# Altium schematic sheet Battery_Management.SchDoc: Battery Management
size A3; SheetNumber: 4; SheetTotal: 6
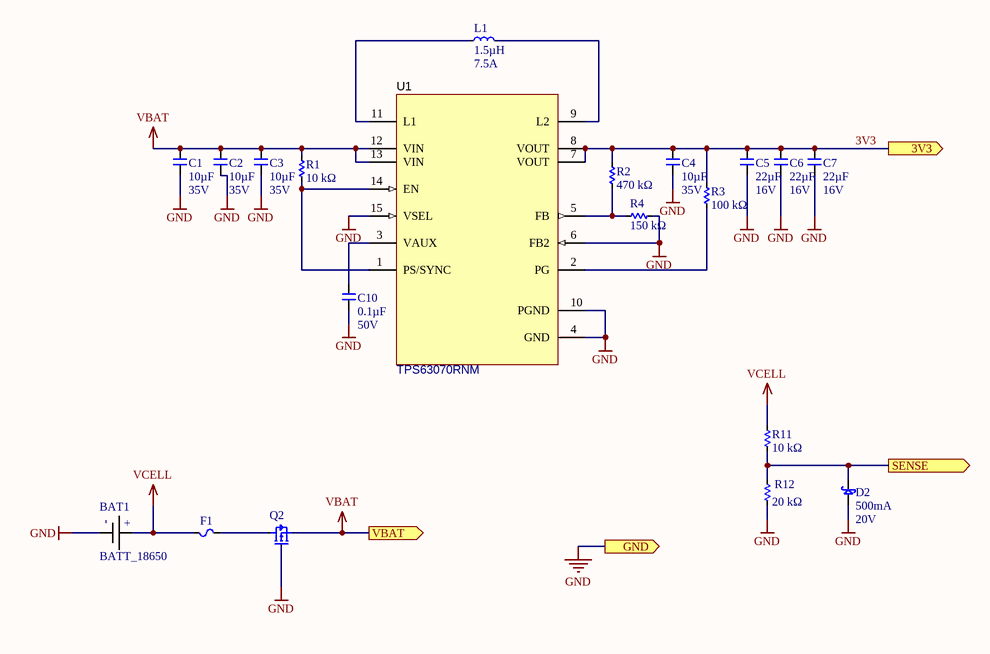
[diagram p0: Battery_Management.SchDoc]

## Parts
BAT1  BATT_18650  [BATT_18650_KEYSTONE_1042_VIAS]
C1  Capacitance (shorthand): 10µF  Rated Voltage: 35V  [C0603]  (hidden comment: 490-13248-1-ND)
C2  Capacitance (shorthand): 10µF  Rated Voltage: 35V  [C0603]  (hidden comment: 490-13248-1-ND)
C3  Capacitance (shorthand): 10µF  Rated Voltage: 35V  [C0603]  (hidden comment: 490-13248-1-ND)
C4  Capacitance (shorthand): 10µF  Rated Voltage: 35V  [C0603]  (hidden comment: 490-13248-1-ND)
C5  Capacitance (shorthand): 22µF  Rated Voltage: 16V  [C0603]  (hidden comment: 1276-7076-1-ND)
C6  Capacitance (shorthand): 22µF  Rated Voltage: 16V  [C0603]  (hidden comment: 1276-7076-1-ND)
C7  Capacitance (shorthand): 22µF  Rated Voltage: 16V  [C0603]  (hidden comment: 1276-7076-1-ND)
C10  Capacitance (shorthand): 0.1µF  Rated Voltage: 50V  [C0603]  (hidden comment: 490-1519-1-ND)
D2  Current - Average Rectified (Io): 500mA  Voltage - DC Reverse (Vr) (Max): 20V  [SOD123]  (hidden comment: Symbol)
F1  Symbol  [R1206]  (value not drawn)
L1  Inductance: 1.5µH  Current Rating: 7.5A  [SMD5230]  (hidden comment: Symbol)
Q2  PFET_SI7615ADN-T1  [POWERPAK_1212-8_SINGLE]  (value not drawn)
R1  Resistance: 10 kΩ  [R0603]  (hidden comment: 311-10.0KHRCT-ND)
R2  Resistance: 470 kΩ  [R0603]  (hidden comment: 311-470KHRCT-ND)
R3  Resistance: 100 kΩ  [R0603]  (hidden comment: 311-100KHRCT-ND)
R4  Resistance: 150 kΩ  [R0603]  (hidden comment: 311-150KHRCT-ND)
R11  Resistance: 10 kΩ  [R0603]  (hidden comment: 311-10.0KHRCT-ND)
R12  Resistance: 20 kΩ  [R0603]  (hidden comment: 311-20.0KHRCT-ND)
U1  TPS63070RNM  [TPS63070]

## Ports
3V3 (out), GND (out), SENSE (out), VBAT (out)

## Nets
GND: BAT1.CELL- C1.2 C2.2 C3.2 C4.2 C5.2 C6.2 C7.2 C10.2 D2.1 Q2.4 R4.2 R12.1 U1.4(GND) U1.6(FB2) U1.10(PGND) U1.15(VSEL) ; port GND
VBAT: C1.1 C2.1 C3.1 Q2.1 R1.2 U1.12(VIN) U1.13(VIN) ; port VBAT
VCELL: BAT1.CELL+ F1.1 R11.2
3V3: C4.1 C5.1 C6.1 C7.1 R2.2 R3.2 U1.7(VOUT) U1.8(VOUT) ; port 3V3
SENSE: D2.2 R11.1 R12.2 ; port SENSE
NetC10_1: C10.1 U1.3(VAUX)
NetF1_2: F1.2 Q2.5
NetL1_1: L1.1 U1.11(L1)
NetL1_2: L1.2 U1.9(L2)
NetR1_1: R1.1 U1.1(PS/SYNC) U1.14(EN)
NetR2_1: R2.1 R4.1 U1.5(FB)
NetR3_1: R3.1 U1.2(PG)

## Notes on the sheet
- Title
- Size:
- Date:
- A3
- Number:
- Time:
- Revision:
- Sheet
- of
- File:
- (in symbol CMP-030-0003-3) +

## Library data of the parts
BAT1 = CMP-030-0003-3: Dual Lithium Ion Cell Holder; Manufacturer: Keystone Electronics; Manufacturer Part Number: 1048P; Battery Type, Function: Cylindrical, Holder; Style: Holder (Open); Battery Cell Size: 18650; Number of Cells: 2; Body Material: Nylon; RoHS: RoHS Compliant; Battery Series: -; Mounting Type: PCB, Surface Mount; Termination Style: SMD (SMT) Tab; Height Above Board: 0.585" (14.86mm); Operating Temperature: -50°C ~ 145°C; ComponentLink1URL: http://www.keyelco.com/product-pdf.cfm?p=13959; ComponentLink1Description: http://www.keyelco.com/product-pdf.cfm?p=13959; Stock 1: 6575; Pricing 1: 1=2.76000, 10=2.32100, 50=2.03840, 250=1.76540, 1000=1.63000, 2500=1.40140, 5000=1.27400 (USD); Mount: Surface Mount; Case/Package: SMD/SMT; Material: Nylon; Contact Plating: Tin; Contact Material: Bronze; Min Operating Temperature: -50°C; Max Operating Temperature: 145°C; Package Quantity: 1; Packaging: Tray; Termination: SMD/SMT; Lead Free: Lead Free; ComponentLink2URL: https://datasheet.ciiva.com/4/1042-4715.pdf?src-supplier=Digi-Key; ComponentLink2Description: https://datasheet.ciiva.com/4/1042-4715.pdf?src-supplier=Digi-Key; ComponentLink3URL: https://datasheet.ciiva.com/3353/key1042-rev-eng-tds-3353207.pdf?src-supplier=Distrelec; ComponentLink3Description: https://datasheet.ciiva.com/3353/key1042-rev-eng-tds-3353207.pdf?src-supplier=Distrelec; Design Item ID: BATT_18650; Source: connector.SchLib
C1-C4 = CMP-119-0071-1: CAP CER 10UF 35V X5R 0603 20%; Manufacturer: Murata Electronics North America; Capacitance - pF (Machine readable): #NAME?; Dielectric: X5R
C5-C7 = CMP-119-0072-1: CAP CER 22UF 16V X5R 0603 20%; Manufacturer: Samsung Electro-Mechanics; Capacitance - pF (Machine readable): #NAME?; Dielectric: X5R
C10 = CMP-119-0065-1: CAP CER 0603 0.1µF X7R 50V 10%; Manufacturer: Murata Electronics North America; Capacitance - pF (Machine readable): #NAME?; Dielectric: X7R
D2 = CMP-033-0037-1: DIODE SCHOTTKY 0.5A 20V SOD-123; Manufacturer: Fairchild Semiconductor; Manufacturer Part Number: MBR0520L; Speed: Fast Recovery =< 500ns, > 200mA (Io); Current - Reverse Leakage @ Vr: 250µA @ 20V; Voltage - Forward (Vf) (Max) @ If: 385mV @ 500mA; RoHS: RoHS Compliant; Stock 1: 217232; Pricing 1: 1=0.63, 10=0.43, 100=0.2024, 250=0.1442, 500=0.11006, 750=0.08603, 1000=0.0759 (USD); Diode Type: Schottky; Reverse Recovery Time (trr): -; Capacitance @ Vr, F: -; Mounting Type: Surface Mount; Package / Case: SOD-123; Supplier Device Package: SOD-123; Packaging: Cut Tape (CT); ComponentLink1URL: http://www.fairchildsemi.com/ds/MB/MBR0520L.pdf; ComponentLink1Description: Datasheet; Design Item ID: SCHOTTKY_MBR0520L; Source: diode.SchLib
F1 = CMP-035-0003-1: Design Item ID: __template_fuse; Source: fuse.SchLib
L1 = CMP-052-0036-1: INDUCTOR POWER 1.5UH 7.5A SMD; Manufacturer: Vishay Dale; Manufacturer Part Number: IHLP2020CZER1R5M11; Current - Saturation: 7A; Tolerance: ±20%; Shielding: Shielded; DC Resistance (DCR): 18.5 mOhm Max; Frequency - Test: 100kHz; RoHS: RoHS Compliant; Stock 1: 17936; Pricing 1: 1=2.29, 10=1.86, 100=1.55, 500=1.24, 1000=1.116 (USD); Material - Core: -; Q @ Freq: -; Frequency - Self Resonant: -; Operating Temperature: -55°C ~ 125°C; Package / Case: Non Standard; Size / Dimension: 0.216" L x 0.204" W x 0.118" H (5.49mm x 5.18mm x 3.00mm); Mounting Type: Surface Mount; Packaging: Cut Tape (CT); ComponentLink1URL: http://www.vishay.com/docs/34260/lp20cz11.pdf; ComponentLink1Description: Datasheet; Design Item ID: IND_IHLP2020CZER1R5M11; Source: inductor.SchLib
Q2 = CMP-078-0043-2: MOSFET P-CH 20V 35A PPK; Manufacturer Part Number: SI7615ADN-T1-GE3; Manufacturer: Vishay Siliconix; Power - Max: 52W; FET Feature: Standard; FET Type: MOSFET P-Channel, Metal Oxide; Rds On (Max) @ Id, Vgs: 4.4 mOhm @ 20A, 10V; Input Capacitance (Ciss) @ Vds: 5590pF @ 10V; Current - Continuous Drain (Id) @ 25°C: 35A (Tc); Vgs(th) (Max) @ Id: 1.5V @ 250µA; Gate Charge (Qg) @ Vgs: 183nC @ 10V; Source: transistor_fet.SchLib; Supplier Device Package: PowerPAK® 1212-8; Drain to Source Voltage (Vdss): 20V; Design Item ID: PFET_SI7615ADN-T1; Stock 1: 98451; Operating Temperature: -55°C ~ 150°C (TJ); RoHS: RoHS Compliant; Pricing 1: 1=0.73, 10=0.646, 25=0.6068, 100=0.4951, 250=0.45988, 500=0.3914, 1000=0.31312 (USD); Mounting Type: Surface Mount; Packaging: Cut Tape (CT); ComponentLink1URL: http://www.vishay.com/docs/62667/si7615adn.pdf; Package / Case: PowerPAK® 1212-8; ComponentLink1Description: http://www.vishay.com/docs/62667/si7615adn.pdf; Part Status: Active
R1 R11 = CMP-126-0273-1: RES SMD 10K OHM 1% 1/10W 0603; Manufacturer Part Number: RC0603FR-0710KL; Manufacturer: Yageo; Resistance (Sortable): 10000; Power (Watts): 0.1W, 1/10W; Temperature Coefficient: ±100ppm/°C; Datasheets: http://www.yageo.com/documents/recent/PYu-RC_Group_51_RoHS_L_9.pdf; Image: //media.digikey.com/Renders/Yageo%20Renders/0603-(1608-Metric).jpg; Tolerance: ±1%; Operating Temperature: -55°C ~ 155°C
R2 = CMP-126-0450-1: RES SMD 470K OHM 1% 1/10W 0603; Manufacturer Part Number: RC0603FR-07470KL; Manufacturer: Yageo; Power (Watts): 0.1W, 1/10W; Resistance (Sortable): 470000; Temperature Coefficient: ±100ppm/°C; Tolerance: ±1%; Datasheets: http://www.yageo.com/documents/recent/PYu-RC_Group_51_RoHS_L_9.pdf; Image: //media.digikey.com/Renders/Yageo%20Renders/0603-(1608-Metric).jpg; Operating Temperature: -55°C ~ 155°C
R3 = CMP-126-0382-1: RES SMD 100K OHM 1% 1/10W 0603; Manufacturer Part Number: RC0603FR-07100KL; Manufacturer: Yageo; Power (Watts): 0.1W, 1/10W; Resistance (Sortable): 100000; Temperature Coefficient: ±100ppm/°C; Tolerance: ±1%; Datasheets: http://www.yageo.com/documents/recent/PYu-RC_Group_51_RoHS_L_9.pdf; Image: //media.digikey.com/Renders/Yageo%20Renders/0603-(1608-Metric).jpg; Operating Temperature: -55°C ~ 155°C
R4 = CMP-126-0400-1: RES SMD 150K OHM 1% 1/10W 0603; Manufacturer Part Number: RC0603FR-07150KL; Manufacturer: Yageo; Power (Watts): 0.1W, 1/10W; Resistance (Sortable): 150000; Temperature Coefficient: ±100ppm/°C; Tolerance: ±1%; Datasheets: http://www.yageo.com/documents/recent/PYu-RC_Group_51_RoHS_L_9.pdf; Image: //media.digikey.com/Renders/Yageo%20Renders/0603-(1608-Metric).jpg; Operating Temperature: -55°C ~ 155°C
R12 = CMP-126-0304-1: RES SMD 20K OHM 1% 1/10W 0603; Manufacturer Part Number: RC0603FR-0720KL; Manufacturer: Yageo; Resistance (Sortable): 20000; Power (Watts): 0.1W, 1/10W; Temperature Coefficient: ±100ppm/°C; Datasheets: http://www.yageo.com/documents/recent/PYu-RC_Group_51_RoHS_L_9.pdf; Image: //media.digikey.com/Renders/Yageo%20Renders/0603-(1608-Metric).jpg; Tolerance: ±1%; Operating Temperature: -55°C ~ 155°C
U1 = CMP-047-0013-1: BUCKBOOST TPS63070RNM, RNM0015A; Manufacturer: Texas Instruments; Manufacturer Part Number: TPS63070RNMR; Quiescent Current: 50uA; Min Input Voltage: 2V; Max Input Voltage: 16V; Output Current: 2A; Switching Frequency: 2.4MHz; Topology: Buck-Boost; Number of Outputs: 1; Min Output Voltage: 2.5V; Max Output Voltage: 9V; Synchronous Rectifier: Yes; Output Type: Adjustable; Output Configuration: Positive; ComponentLink1Description: Datasheet Link; ComponentLink1URL: https://sps06.itg.ti.com/sites/KMS/crossdivteams/altium/docs/ComponentDatasheets/TPS63070_datasheet_23_April2015.pdf; Stock 1: 16230; Pricing 1: 1=2.67, 10=2.402, 100=1.9306, 500=1.5862, 1000=1.31428 (USD); Mount: Surface Mount; Case/Package: VQFN; Number of Pins: 15; Min Operating Temperature: -40°C; Max Operating Temperature: 125°C; Packaging: Tape and Reel; Lead Free: Lead Free; Design Item ID: TPS63070RNM; Source: ic_pmic.SchLib